# EAGLE design MODUL_RAIL_IN_V100 (EAGLE 6.4)

## Sheet 1 of 2
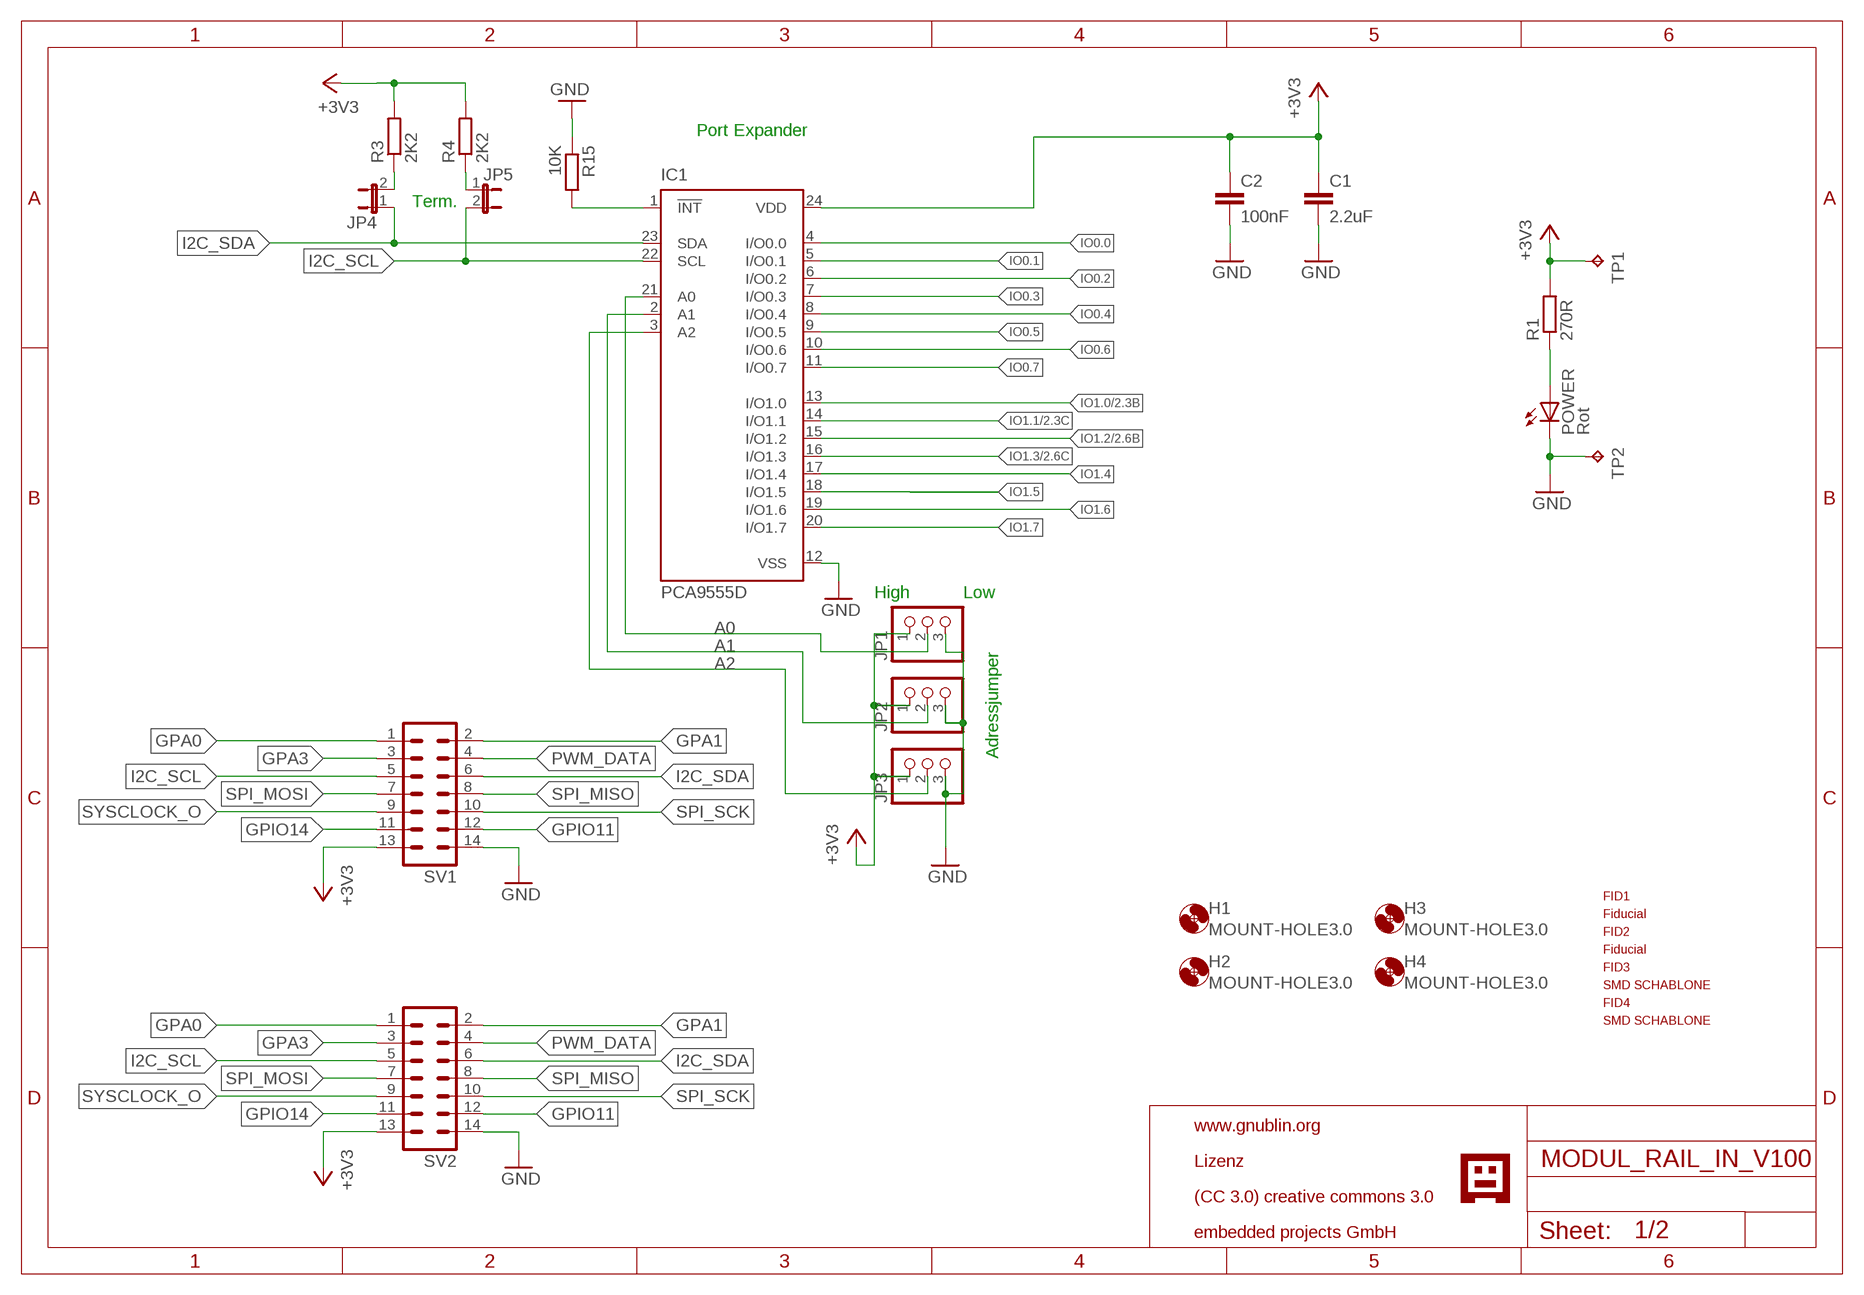
[diagram p0: schematic, sheet 1]

### Parts
C1  2.2uF  C-EUC0805  [C0805]
C2  100nF  C-EUC0805  [C0805]
FID1  PASSERMARKEN_FIDUCIAL  [PASSERMARKEN_FIDUCIAL]
FID2  PASSERMARKEN_FIDUCIAL  [PASSERMARKEN_FIDUCIAL]
FID3  PASSERMARKEN_FIDUCIAL  [PASSERMARKEN_FIDUCIAL]
FID4  PASSERMARKEN_FIDUCIAL  [PASSERMARKEN_FIDUCIAL]
H1  MOUNT-HOLE3.0  [3,0]
H2  MOUNT-HOLE3.0  [3,0]
H3  MOUNT-HOLE3.0  [3,0]
H4  MOUNT-HOLE3.0  [3,0]
IC1  PCA9555D  [SO24]
JP1  PINHD-1X3  [1X03]
JP2  PINHD-1X3  [1X03]
JP3  PINHD-1X3  [1X03]
JP4  JP1E  [JP1]
JP5  JP1E  [JP1]
POWER  Rot  LEDCHIP-LED0805  [CHIP-LED0805]
R1  270R  R-EU_R0805  [R0805]
R3  2K2  R-EU_R0805  [R0805]
R4  2K2  R-EU_R0805  [R0805]
R15  10K  R-EU_R0805  [R0805]
SV1  ML14  [ML14]
SV2  ML14  [ML14]
TP1  TPB1,27  [B1,27]
TP2  TPB1,27  [B1,27]
U$2  GNUBLINLOGOSIEB  [GNUSIEBDRUCK]

### Nets
!INT: IC1.1(!INT) R15.2
+3V3: C1.1 C2.1 IC1.24(VDD) JP1.1 JP2.1 JP3.1 R1.2 R3.2 R4.2 SV1.13 SV2.13 TP1.TP ; also sheet 2
A0: IC1.21(A0) JP1.2
A1: IC1.2(A1) JP2.2
A2: IC1.3(A2) JP3.2
GND: C1.2 C2.2 IC1.12(VSS) JP1.3 JP2.3 JP3.3 POWER.C R15.1 SV1.14 SV2.14 TP2.TP ; also sheet 2
GPA0: SV1.1 SV2.1
GPA1: SV1.2 SV2.2
GPA3: SV1.3 SV2.3
GPIO11: SV1.12 SV2.12
GPIO14: SV1.11 SV2.11
I2C_SCL: IC1.22(SCL) JP5.2 SV1.5 SV2.5
I2C_SDA: IC1.23(SDA) JP4.1 SV1.6 SV2.6
IO0.0: IC1.4(I/O0.0)
IO0.1: IC1.5(I/O0.1)
IO0.2: IC1.6(I/O0.2)
IO0.3: IC1.7(I/O0.3)
IO0.4: IC1.8(I/O0.4)
IO0.5: IC1.9(I/O0.5)
IO0.6: IC1.10(I/O0.6)
IO0.7: IC1.11(I/O0.7)
IO1.0: IC1.13(I/O1.0) ; also sheet 2
IO1.1: IC1.14(I/O1.1) ; also sheet 2
IO1.2: IC1.15(I/O1.2) ; also sheet 2
IO1.3: IC1.16(I/O1.3) ; also sheet 2
IO1.4: IC1.17(I/O1.4)
IO1.5: IC1.18(I/O1.5)
IO1.6: IC1.19(I/O1.6)
IO1.7: IC1.20(I/O1.7)
N$1: JP4.2 R3.1
N$2: POWER.A R1.1
N$5: JP5.1 R4.1
PWM_DATA: SV1.4 SV2.4
SPI_MISO: SV1.8 SV2.8
SPI_MOSI: SV1.7 SV2.7
SPI_SCK: SV1.10 SV2.10
SYSCLOCK_O: SV1.9 SV2.9

### Notes on the sheet
- Port Expander
- Term.
- High | Low
- Adressjumper
- www.gnublin.org
- Lizenz
- (CC 3.0) creative commons 3.0
- embedded projects GmbH

## Sheet 2 of 2
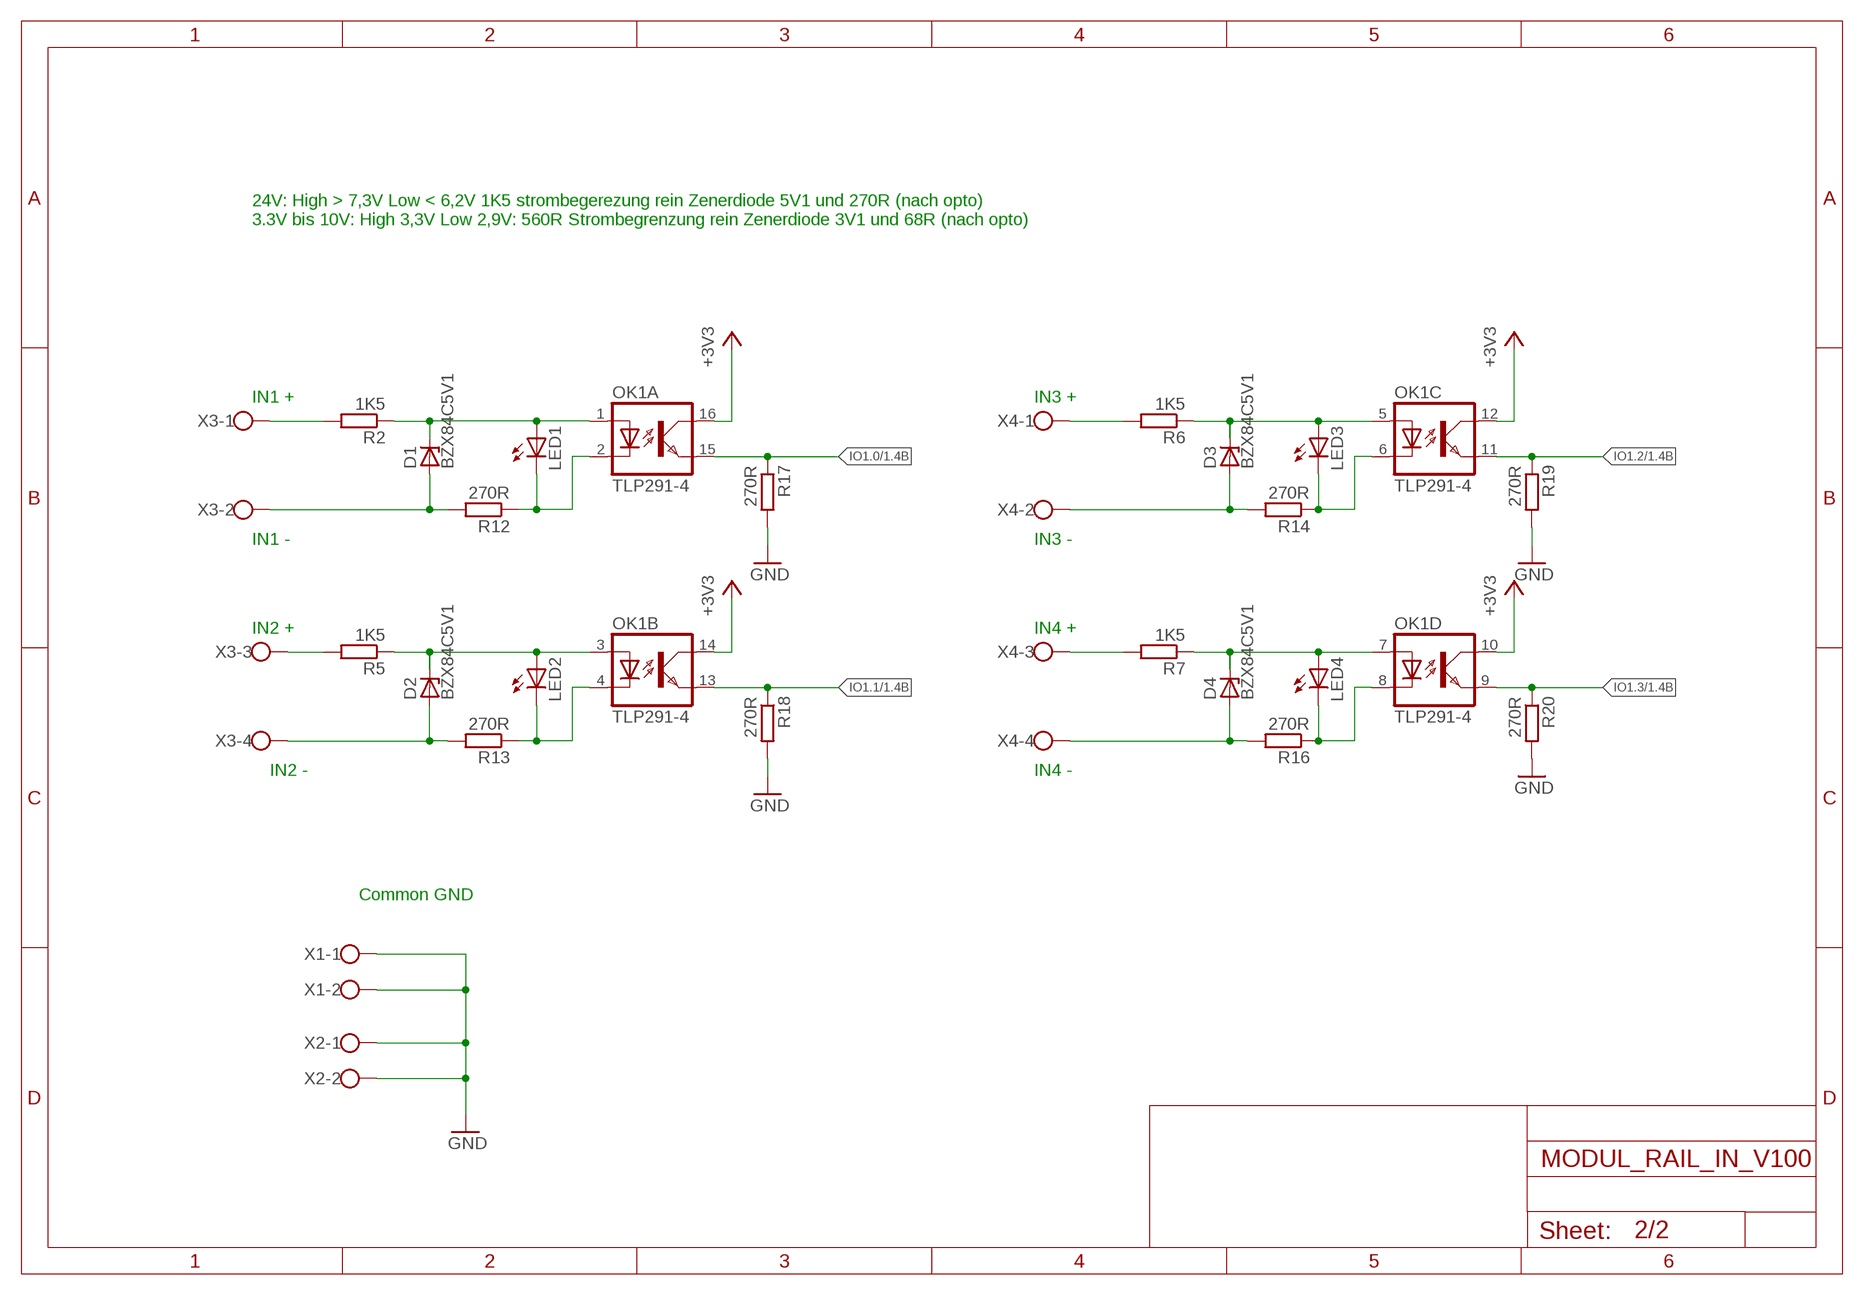
[diagram p1: schematic, sheet 2]

### Parts
D1  BZX84C5V1  BZX84CSMD  [TO236]
D2  BZX84C5V1  BZX84CSMD  [TO236]
D3  BZX84C5V1  BZX84CSMD  [TO236]
D4  BZX84C5V1  BZX84CSMD  [TO236]
LED1  LEDCHIPLED_0805  [CHIPLED_0805]
LED2  LEDCHIPLED_0805  [CHIPLED_0805]
LED3  LEDCHIPLED_0805  [CHIPLED_0805]
LED4  LEDCHIPLED_0805  [CHIPLED_0805]
OK1  TLP291-4  TLP283-4  [MINI-FLAT-16]
R2  1K5  R-EU_R0805  [R0805]
R5  1K5  R-EU_R0805  [R0805]
R6  1K5  R-EU_R0805  [R0805]
R7  1K5  R-EU_R0805  [R0805]
R12  270R  R-EU_R0805  [R0805]
R13  270R  R-EU_R0805  [R0805]
R14  270R  R-EU_R0805  [R0805]
R16  270R  R-EU_R0805  [R0805]
R17  270R  R-EU_R0805  [R0805]
R18  270R  R-EU_R0805  [R0805]
R19  270R  R-EU_R0805  [R0805]
R20  270R  R-EU_R0805  [R0805]
X1  W237-02P  [W237-132]
X2  W237-02P  [W237-132]
X3  W237-04P  [W237-4P]
X4  W237-04P  [W237-4P]

### Nets
+3V3: OK1.10(D:COL) OK1.12(C:COL) OK1.14(B:COL) OK1.16(A:COL) ; also sheet 1
GND: R17.2 R18.2 R19.2 R20.2 X1.1 X1.2 X2.1 X2.2 ; also sheet 1
IO1.0: OK1.15(A:EMIT) R17.1 ; also sheet 1
IO1.1: OK1.13(B:EMIT) R18.1 ; also sheet 1
IO1.2: OK1.11(C:EMIT) R19.1 ; also sheet 1
IO1.3: OK1.9(D:EMIT) R20.1 ; also sheet 1
N$3: R2.2 X3.1
N$4: D1.C LED1.A OK1.1(A:A) R2.1
N$6: LED1.C OK1.2(A:C) R12.1
N$7: R5.2 X3.3
N$8: D2.C LED2.A OK1.3(B:A) R5.1
N$9: LED2.C OK1.4(B:C) R13.1
N$10: D1.A R12.2 X3.2
N$11: R6.2 X4.1
N$12: D3.C LED3.A OK1.5(C:A) R6.1
N$13: R7.2 X4.3
N$14: D4.C LED4.A OK1.7(D:A) R7.1
N$15: LED3.C OK1.6(C:C) R14.1
N$16: D2.A R13.2 X3.4
N$17: LED4.C OK1.8(D:C) R16.1
N$18: D3.A R14.2 X4.2
N$19: D4.A R16.2 X4.4

### Notes on the sheet
- 24V: High > 7,3V Low < 6,2V 1K5 strombegerezung rein Zenerdiode 5V1 und 270R (nach opto)
  3.3V bis 10V: High 3,3V Low 2,9V: 560R Strombegrenzung rein Zenerdiode 3V1 und 68R (nach opto)
- IN1 + | IN3 +
- IN1 - | IN3 -
- IN2 + | IN4 +
- IN2 - | IN4 -
- Common GND

## Library data of the parts
C1 C2 = rcl:C-EU: CAPACITOR, European symbol
D1 = diode:BZX84CSMD: Z DIODE; FARNELL: 1081430
D2-D4 = diode:BZX84CSMD: Z DIODE
FID1 FID2 = KUBUS3:PASSERMARKEN_FIDUCIAL: SMD Passermarke
FID3 FID4 = SMDSCHABLONE:PASSERMARKEN_FIDUCIAL: SMD Passermarke
H1-H4 = holes:MOUNT-HOLE: MOUNTING HOLE with drill center marker
IC1 = micro-philips:PCA9555: 16-bit I2C and SMBus I/O port with interrupt Source: PCA9555_5.pdf; MPN: PCA9555DW; OC_FARNELL: 8906076; OC_NEWARK: 63K6067
JP1-JP3 = pinhead:PINHD-1X3: PIN HEADER
JP4 JP5 = jumper:JP1E: JUMPER
LED1-LED4 POWER = led:LED: LED OSRAM: - CHIPLED LG R971, LG N971, LY N971, LG Q971, LY Q971, LO R971, LY R971 LH N974, LH R974 LS Q976, LO Q976, LY Q976 LO Q996 - Hyper CHIPLED LW Q18S LB Q993, LB Q99A, LB R99A - SideLED LS A670, LO A670, LY A670, LG A670, LP A670 LB A673, LV A673, LT A673, LW A673 LH A674 LY A675 LS A676, LA A676, LO A676, LY A676, LW A676 LS A679, LY A679, LG A679 - Hyper Micro SIDELED® LS Y876, LA Y876, LO Y876, LY Y876 LT Y87S - SmartLED LW L88C, LW L88S LB L89C, LB L89S, LG L890 LS L89K, LO L89K, LY L89K LS L896, LA L896, LO L896, LY L896 - TOPLED LS T670, LO T670, LY T670, LG T670, LP T670 LSG T670, LSP T670, LSY T670, LOP T670, LYG T670 LG T671, LOG T671, LSG T671 LB T673, LV T673, LT T673, LW T673 LH T674 LS T676, LA T676, LO T676, LY T676, LB T676, LH T676, LSB T676, LW T676 LB T67C, LV T67C, LT T67C, LS T67K, LO T67K, LY T67K, LW E67C LS E67B, LA E67B, LO E67B, LY E67B, LB E67C, LV E67C, LT E67C LW T67C LS T679, LY T679, LG T679 LS T770, LO T770, LY T770, LG T770, LP T770 LB T773, LV T773, LT T773, LW T773 LH T774 LS E675, LA E675, LY E675, LS T675 LS T776, LA T776, LO T776, LY T776, LB T776 LHGB T686 LT T68C, LB T68C - Hyper Mini TOPLED® LB M676 - Mini TOPLED Santana® LG M470 LS M47K, LO M47K, LY M47K Source: http://www.osram.convergy.de LUXEON: - LUMILED® LXK2-PW12-R00, LXK2-PW12-S00, LXK2-PW14-U00, LXK2-PW14-V00 LXK2-PM12-R00, LXK2-PM12-S00, LXK2-PM14-U00 LXK2-PE12-Q00, LXK2-PE12-R00, LXK2-PE12-S00, LXK2-PE14-T00, LXK2-PE14-U00 LXK2-PB12-K00, LXK2-PB12-L00, LXK2-PB12-M00, LXK2-PB14-N00, LXK2-PB14-P00, LXK2-PB14-Q00 LXK2-PR12-L00, LXK2-PR12-M00, LXK2-PR14-Q00, LXK2-PR14-R00 LXK2-PD12-Q00, LXK2-PD12-R00, LXK2-PD12-S00 LXK2-PH12-R00, LXK2-PH12-S00 LXK2-PL12-P00, LXK2-PL12-Q00, LXK2-PL12-R00 Source: www.luxeon.com KINGBRIGHT: KA-3528ASYC Source: www.kingbright.com
OK1 = optocoupler:TLP283-4: TOSHIBA PHOTOCOUPLER GaAs IRED & PHOTO-TRANSISTOR Source: http://www.semicon.toshiba.co.jp/td/en/Opto/Photocoupler/en_20050928_TLP283_datasheet.pdf
R1-R7 R12-R20 = rcl:R-EU_: RESISTOR, European symbol
SV1 SV2 = con-ml:ML14: HARTING; OC_FARNELL: unknown; OC_NEWARK: unknown
TP1 TP2 = testpad:TP: Test pad
U$2 = EmbeddedProjectsLogos2:GNUBLINLOGO
X1 X2 = con-wago-508:W237-02P: WAGO SREW CLAMP
X3 X4 = con-wago-508:W237-04P: WAGO SREW CLAMP

## Board
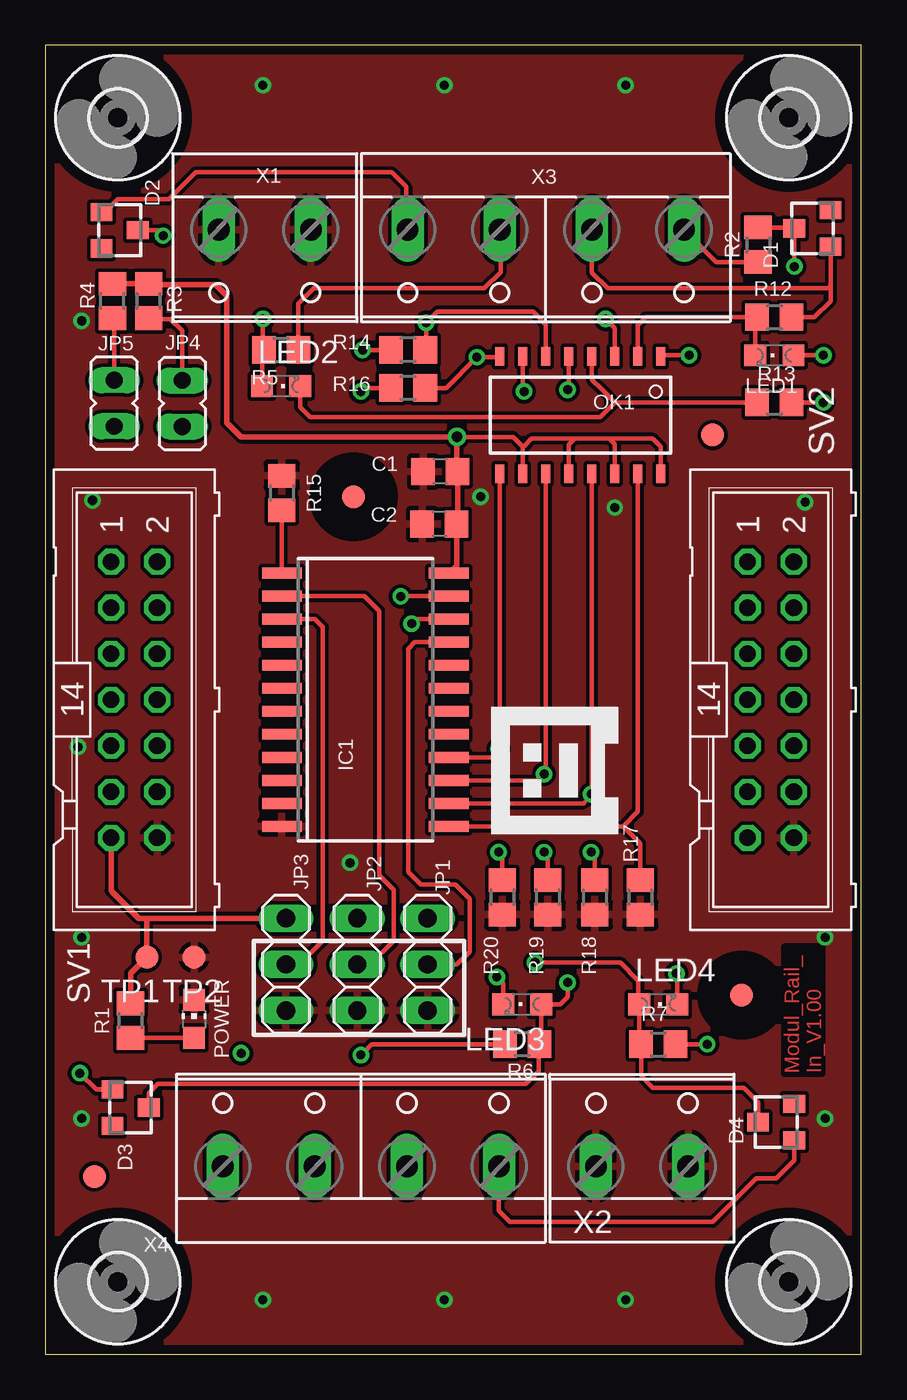
[diagram p2: board, top side]
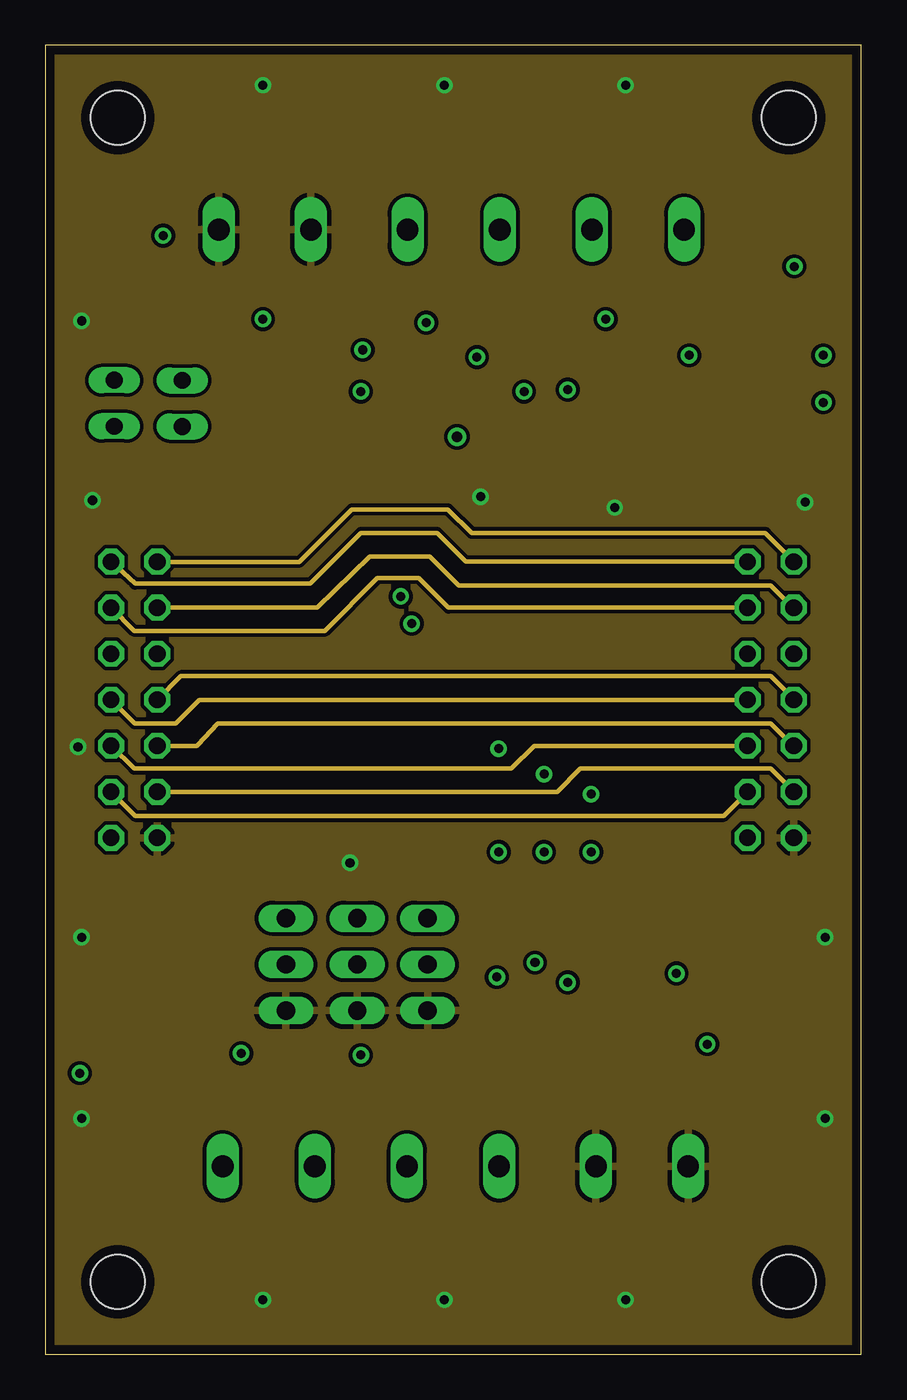
[diagram p3: board, inner layer Route2]
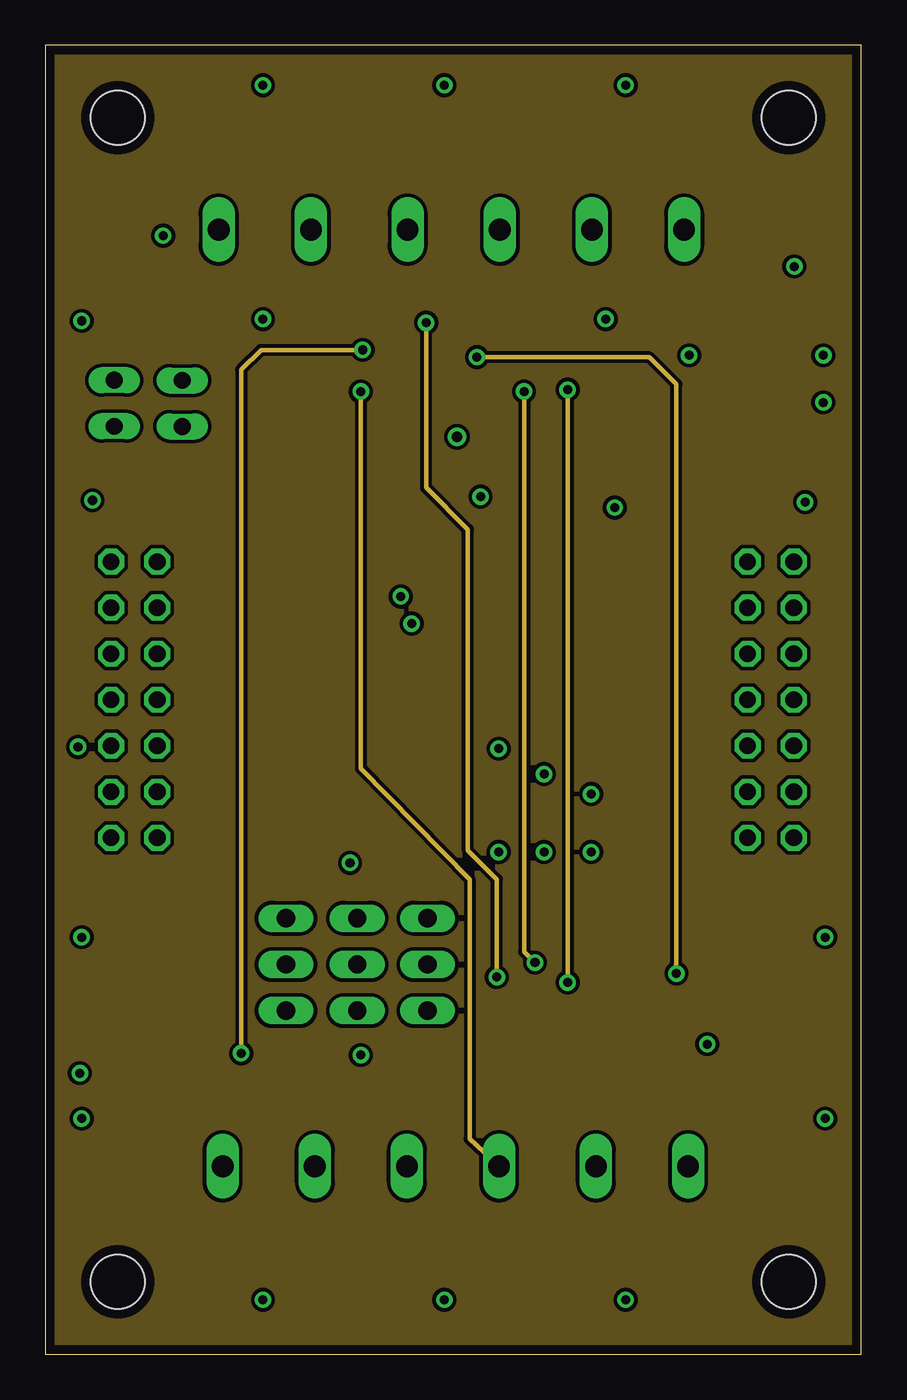
[diagram p4: board, inner layer Route15]
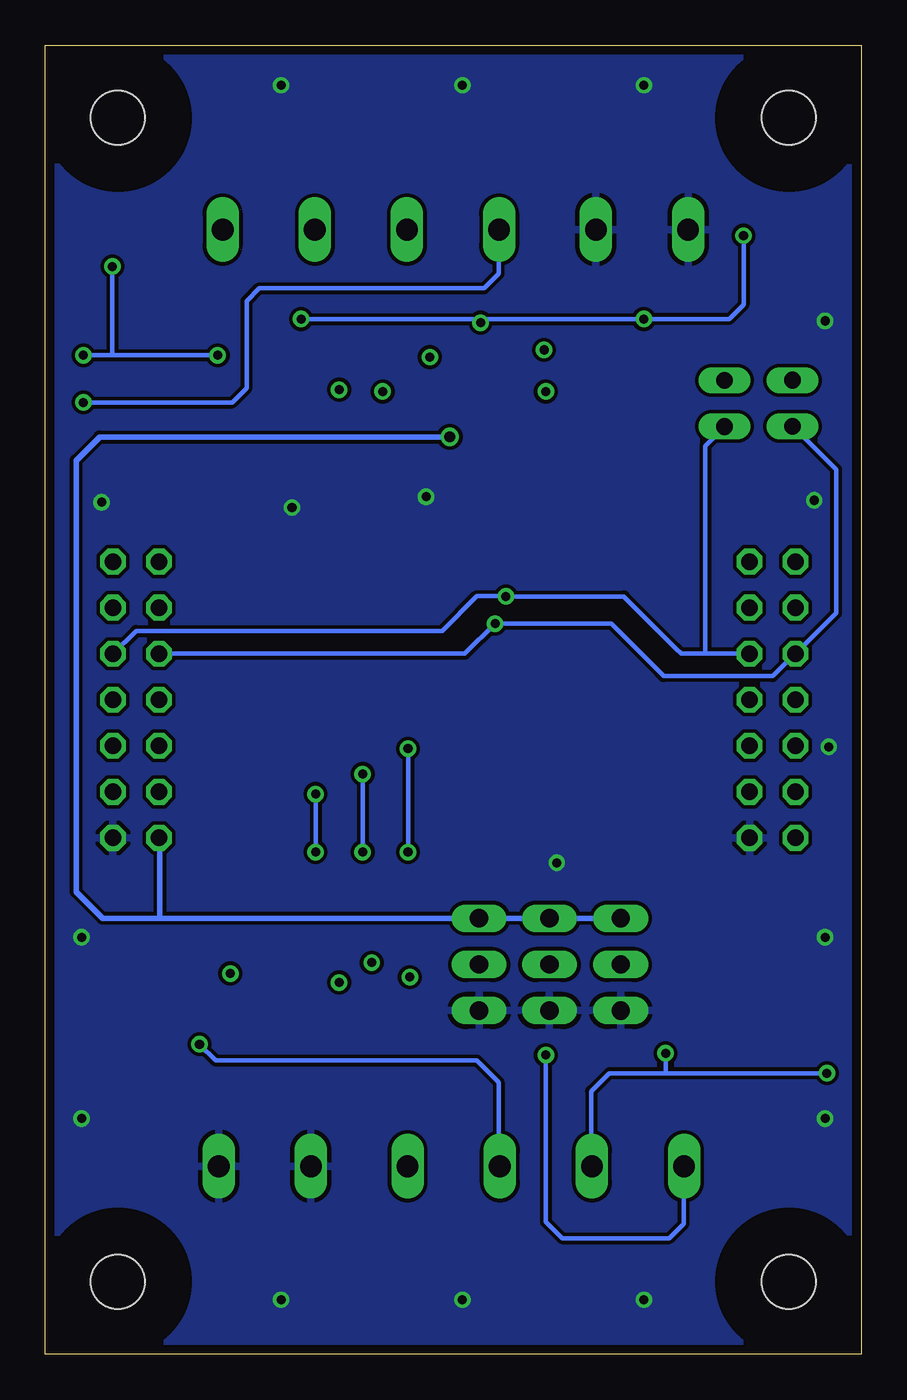
[diagram p5: board, bottom side, seen from below]

Size 45 x 72.2 mm. Coordinates in mm from the lower left corner, seen from the top.
Outline: 0,0 45,0 45,72.2 0,72.2 0,0
Copper layers (1*2+15*16): Top 0.035mm / dielectric 1.5mm / Route2 0.035mm / dielectric 0.15mm / Route15 0.035mm / dielectric 0.2mm / Bottom 0.035mm
Design rules "default *": minimum track width 10mil, minimum drill 24mil, track to track 8mil, track to pad 8mil, pad to pad 8mil, via to via 8mil, smd to smd 8mil, copper to edge 20mil, drill to drill 8mil, minimum pad ring 10mil, minimum via ring 8mil, stop-mask expansion 4mil, vias tented up to drill 40mil, thermal gap 10mil

### Footprints (pad centres in the part's own frame; a part is rotated, then mirrored left to right if it is on the bottom)
C0805 = smd 1.3 x 1.5: 1 -0.95,0; 2 0.95,0
TO236 = smd 1 x 1.2: A -1,-1; C 0,1; NC 1,-1
PASSERMARKEN_FIDUCIAL = smd 1.27 x 1.27: 1 0,0
3,0 = hole 3: 0,0
SO24 = smd 0.6 x 2.2: 1 -6.985,-4.6; 2 -5.715,-4.6; 3 -4.445,-4.6; 4 -3.175,-4.6; 5 -1.905,-4.6; 6 -0.635,-4.6; 7 0.635,-4.6; 8 1.905,-4.6; 9 3.175,-4.6; 10 4.445,-4.6; 11 5.715,-4.6; 12 6.985,-4.6; 13 6.985,4.6; 14 5.715,4.6; 15 4.445,4.6; 16 3.175,4.6; 17 1.905,4.6; 18 0.635,4.6; 19 -0.635,4.6; 20 -1.905,4.6; 21 -3.175,4.6; 22 -4.445,4.6; 23 -5.715,4.6; 24 -6.985,4.6
1X03 = drill 1.016 long: 1 -2.54,0; 2 0,0; 3 2.54,0
JP1 = drill 0.914 long: 1 0,-1.27; 2 0,1.27
CHIPLED_0805 = smd 1.2 x 1.2: A 0,-1.05; C 0,1.05
MINI-FLAT-16 = smd 1 x 0.5: 1 -3.24,4.445; 2 -3.24,3.175; 3 -3.24,1.905; 4 -3.24,0.635; 5 -3.24,-0.635; 6 -3.24,-1.905; 7 -3.24,-3.175; 8 -3.24,-4.445; 9 3.24,-4.445; 10 3.24,-3.175; 11 3.24,-1.905; 12 3.24,-0.635; 13 3.24,0.635; 14 3.24,1.905; 15 3.24,3.175; 16 3.24,4.445
CHIP-LED0805 = smd 1.2 x 1.2: A 0,-1.05; C 0,1.05
R0805 = smd 1.3 x 1.5: 1 -0.95,0; 2 0.95,0
ML14 = drill 0.914 octagon: 1 -7.62,-1.27; 2 -7.62,1.27; 3 -5.08,-1.27; 4 -5.08,1.27; 5 -2.54,-1.27; 6 -2.54,1.27; 7 0,-1.27; 8 0,1.27; 9 2.54,-1.27; 10 2.54,1.27; 11 5.08,-1.27; 12 5.08,1.27; 13 7.62,-1.27; 14 7.62,1.27
B1,27 = smd 1.27 x 1.27: TP 0,0
W237-132 = drill 1.194 long: 1 -2.54,-0.635; 2 2.54,-0.635
W237-4P = drill 1.194 long: 1 -7.62,-0.635; 2 -2.54,-0.635; 3 2.54,-0.635; 4 7.62,-0.635

### Placement (x,y rotation side)
C1  21.78,48.69 180 top
C2  21.73,45.79 180 top
D1  42.3,62.1 90 top
D2  4.1,62 270 top
D3  4.7,13.6 270 top
D4  40.3,12.8 90 top
FID1  17,47.3 0 top
FID2  38.4,19.8 0 top
FID3  36.8,50.7 0 top
FID4  2.7,9.8 0 top
H1  4,4 0 top
H2  41,4 0 top
H3  41,68.2 0 top
H4  4,68.2 0 top
IC1  17.65,36.1 270 top
JP1  21.08,21.5 270 top
JP2  17.2,21.5 270 top
JP3  13.27,21.5 270 top
JP4  7.55,52.44 0 top
JP5  3.8,52.46 180 top
LED1  40.2,55.1 90 top
LED2  13,53.4 270 top
LED3  26.3,19.3 90 top
LED4  33.8,19.3 270 top
OK1  29.5,51.8 270 top
POWER  8.2,18.5 0 top
R1  4.7,18.4 90 top
R2  39.3,61.2 270 top
R3  5.7,58.1 90 top
R4  3.7,58.1 90 top
R5  13,55.4 0 top
R6  26.3,17.1 180 top
R7  33.8,17.1 0 top
R12  40.2,57.2 0 top
R13  40.2,52.5 0 top
R14  20,55.4 180 top
R15  13.04,47.51 270 top
R16  20,53.3 180 top
R17  32.8,25.2 270 top
R18  30.3,25.2 270 top
R19  27.7,25.2 270 top
R20  25.2,25.2 270 top
SV1  4.9,36.1 270 top
SV2  40,36.1 270 top
TP1  5.6,21.9 0 top
TP2  8.2,21.9 0 top
U$2  31.6,28.7 90 top
X1  12.1,61.4 180 top
X2  32.9,11 0 top
X3  27.6,61.4 180 top
X4  17.4,11 0 top

### Tracks (layer width: path | path; a pad name or v marks a point on that pad's centre or on a via)
!INT
  Top 0.254: IC1.1 R15.2
+3V3  (via drill 0.6)
  Top 0.254: 31.1,50.5 33.5,50.5 33.95,50.05 OK1.16 | 31.1,50.5 29.2,50.5 | 29.2,50.5 26.8,50.5 26.4,50.1 26.32,50.02 | OK1.10 26.32,50.02 | 29.2,50.5 28.86,50.16 OK1.12 | 31.1,50.5 31.41,50.2 OK1.14 | 26.32,50.02 26.32,50.08 25.8,50.6 v22.7,50.6
  Top 0.305: IC1.24 22.68,43.52 C2.1 22.73,46.44 C1.1 22.7,48.72 v22.7,50.6 22.2,50.6 10.8,50.6 10,51.4 10,58.3 10,58.4 9.4,59 5.75,59 R3.2 R4.2 | JP3.1 5.5,24.04 | 5.5,24.04 5.16,24.04 3.7,25.5 3.63,25.57 SV1.13 | R1.2 4.7,21 TP1.TP 5.6,23.94 5.5,24.04
  Bottom 0.305: SV2.13 38.7,28.45 38.7,24.04 | v22.7,50.6 22.8,50.6 42,50.6 43.3,49.3 43.3,27.1 43.3,25.5 41.84,24.04 38.7,24.04 | JP3.1 JP2.1 JP1.1 37.27,24.04 38.7,24.04
A0
  Top 0.254: IC1.21 20.38,39.27 20,38.9 20,26.6 20.7,25.9 22.6,25.9 23.4,25.1 23.4,22.2 22.7,21.5 JP1.2
A1
  Top 0.254: IC1.2 17.59,41.81 18.4,41 18.4,26.4 19.2,25.6 19.2,22.8 17.9,21.5 JP2.2
A2
  Top 0.254: JP3.2 14,21.5 15.3,22.8 15.3,40.1 15.1,40.3 14.86,40.55 IC1.3
GND  (via drill 0.5)
  other vias: 2,23 1.8,33.5 2,57 2.6,47.1 2,13 12,3 22,3 32,3 43,13 43,23 41.9,47 12,70 22,70 32,70 16.8,27.1 31.4,46.7 24,47.3
  pour Bottom: -2.7,-3.6 50.2,-3.3 49.2,75.6 -3.7,75.3
  pour Top: -2.7,-3.3 49.6,-3.1 49,74.9 -3.3,74.7
  pour Route2: -0.6,72.7 45.3,72.6 45.5,-1.6 -0.4,-1.5
GNDA
  pour Route15: 0.2,72.5 45.2,72.4 45,-0.2 0,-0.1
GPA0
  Route2 0.254: SV2.1 23.18,43.72 21.6,45.3 17.4,45.3 14.6,42.5 4.95,42.5 SV1.1
GPA1
  Route2 0.254: SV2.2 39.7,45.3 23.5,45.3 22.2,46.6 16.9,46.6 14,43.7 6.19,43.7 SV1.2
GPA3
  Route2 0.254: SV2.3 22.22,41.18 20.6,42.8 18.3,42.8 15.4,39.9 4.91,39.9 SV1.3
GPIO11
  Route2 0.254: SV2.12 40,32.3 29.5,32.3 28.22,31.02 SV1.12
GPIO14
  Route2 0.254: SV1.11 4.95,29.7 37.41,29.7 SV2.11
I2C_SCL  (via drill 0.5)
  Top 0.254: IC1.22 20.45,40.55 v20.2,40.3
  Bottom 0.254: JP5.2 1.4,48.8 1.4,40.87 SV1.5 3.66,38.64 4.9,37.4 10.9,37.4 11.1,37.6 13.8,40.3 v20.2,40.3 21.86,38.64 SV2.5
I2C_SDA  (via drill 0.5)
  Top 0.254: IC1.23 19.61,41.81 v19.6,41.8
  Bottom 0.254: SV1.6 7.6,38.64 8.6,38.64 | 8.6,38.64 9.94,38.64 10.2,38.9 13.1,41.8 v19.6,41.8 19.61,41.81 21.2,41.81 23.11,39.9 40,39.9 SV2.6 | JP4.1 7.55,51.15 8.6,50.1 8.6,38.64
IO1.0
  Top 0.254: OK1.15 32.67,29.93 31.86,29.11 | IC1.13 31.82,29.11 31.86,29.11 | R17.1 32.8,28.18 31.86,29.11
IO1.1  (via drill 0.5)
  Top 0.254: IC1.14 29.68,30.39 v30.1,30.9 30.14,30.96 OK1.13 | v30.1,27.7 30.3,27.5 R18.1
  Bottom 0.254: v30.1,30.9 v30.1,27.7
IO1.2  (via drill 0.5)
  Top 0.254: IC1.15 27.16,31.66 v27.5,32 27.59,32.1 OK1.11 | v27.5,27.7 27.7,27.5 R19.1
  Bottom 0.254: v27.5,32 v27.5,27.7
IO1.3  (via drill 0.5)
  Top 0.254: IC1.16 24.62,32.92 v25,33.4 25.05,33.45 OK1.9 | v25,27.7 25.2,27.5 R20.1
  Bottom 0.254: v25,33.4 v25,27.7
N$1
  Top 0.254: JP4.2 7.55,56.45 6.9,57.1 5.75,57.1 R3.1
N$2
  Top 0.254: R1.1 POWER.A
N$3
  Top 0.254: R2.2 37.01,60.25 X3.1
N$4  (via drill 0.5)
  Top 0.254: R2.1 41.3,62.15 D1.C v41.3,60 | v35.5,55.1 34.01,55.1 OK1.1 | LED1.A v42.9,55.1
  Bottom 0.254: v42.9,55.1 LED1.A | LED1.A v35.5,55.1 | v41.3,60 41.3,55.15 LED1.A
N$5
  Top 0.254: JP5.1 3.8,56.92 R4.1
N$6
  Top 0.254: OK1.2 32.67,56.77 33.1,57.2 R12.1 39.15,57.1 LED1.C
N$7
  Top 0.254: R5.2 13.95,57.95 14.8,58.8 24.2,58.8 25.1,59.7 25.1,61.99 X3.3
N$8  (via drill 0.5)
  Top 0.254: LED2.A 11.95,55.3 R5.1 12,55.45 v12,57.1 | D2.C 6.2,62 v6.5,61.7 | OK1.3 31.41,56.59 v30.9,57.1
  Bottom 0.254: v6.5,61.7 6.5,57.9 7.3,57.1 11.7,57.1 v12,57.1 v30.9,57.1
N$9
  Top 0.254: OK1.4 30.14,53.77 30.7,53.2 31.4,52.5 | R13.1 31.4,52.5 | LED2.C 14.05,52.25 14.6,51.7 30.6,51.7 31.4,52.5
N$10
  Top 0.254: D1.A 43.3,59 | 43.3,59 43.3,58.1 42.4,57.2 R12.2 | X3.2 30.14,59.66 31,58.8 43.2,58.8 43.3,59
N$11  (via drill 0.5)
  Top 0.254: R6.2 18,17.1 v17.4,16.5
  Bottom 0.254: v17.4,16.5 17.4,7.3 16.5,6.4 10.6,6.4 9.8,7.2 9.8,10.35 X4.1
N$12  (via drill 0.5)
  Top 0.254: OK1.5 28.86,53.27 v28.8,53.2 | v28.8,20.5 28.8,19.7 28.4,19.3 LED3.A 27.35,17.2 R6.1 27.2,17.05 27.2,15.6 26.5,14.9 6.2,14.9 5.7,14.4 D3.C
  Route15 0.254: v28.8,53.2 v28.8,20.5
N$13  (via drill 0.5)
  Top 0.254: R7.2 v36.5,17.1
  Bottom 0.254: v36.5,17.1 35.6,16.2 21.2,16.2 20,15 20,10.43 X4.3
N$14  (via drill 0.5)
  Top 0.254: OK1.7 26.32,53.17 v26.4,53.1 | v27,21.6 30,21.6 31.7,21.6 32.7,20.6 32.7,19.35 LED4.A 32.75,17.2 R7.1 32.85,15.35 33.5,14.7 38.5,14.7 39.3,13.9 D4.C
  Route15 0.254: v26.4,53.1 26.4,22.2 v27,21.6
N$15  (via drill 0.5)
  Top 0.254: OK1.6 27.59,56.8 26.9,57.5 21.7,57.5 21.6,57.5 v21,56.9 21,55.45 R14.1 20.9,55.65 | LED3.C 25.25,20.45 v24.9,20.8
  Route15 0.254: v24.9,20.8 24.9,26.2 23.3,27.8 23.3,45.5 21,47.8 v21,56.9
N$16  (via drill 0.5)
  Top 0.254: R13.2 v42.9,52.5 | D2.A 3.3,63 4,63.7 6.8,63.7 8.3,65.2 19.1,65.2 19.9,64.4 19.9,62.12 X3.4
  Bottom 0.254: v42.9,52.5 34.7,52.5 33.9,53.3 33.9,58.1 33.2,58.8 20.8,58.8 20,59.6 20,62.02 X3.4
N$17  (via drill 0.5)
  Top 0.254: LED4.C 34.85,20.95 v34.8,21 | OK1.8 25.02,55 v23.8,55 22.1,53.3 R16.1
  Route15 0.254: v34.8,21 34.8,53.5 33.3,55 v23.8,55
N$18  (via drill 0.5)
  Top 0.254: R14.2 v17.5,55.4 | D3.A 2.8,14.6 v1.9,15.5
  Route15 0.254: v17.5,55.4 11.9,55.4 10.8,54.3 v10.8,16.6
  Bottom 0.254: v1.9,15.5 10.8,15.5 | 10.8,15.5 13.9,15.5 14.9,14.5 14.9,10.4 X4.2 | v10.8,16.6 10.8,15.5
N$19  (via drill 0.5)
  Top 0.254: D4.A 41.3,10.7 40.3,9.7 39.2,9.7 36.8,7.3 25.6,7.3 25,7.9 25,10.35 X4.4 | R16.2 17.6,53.3 v17.4,53.1
  Route15 0.254: v17.4,53.1 17.4,32.3 23.4,26.2 23.4,11.88 X4.4
PWM_DATA
  Route2 0.254: SV2.4 41.22,41.18 40,42.4 22.8,42.4 21.2,44 17.9,44 15,41.2 6.19,41.2 SV1.4
SPI_MISO
  Route2 0.254: SV2.8 41.27,36.13 40,37.4 7.47,37.4 SV1.8
SPI_MOSI
  Route2 0.254: SV2.7 8.5,36.1 7.2,34.8 4.93,34.8 SV1.7
SPI_SCK
  Route2 0.254: SV2.10 41.24,33.56 40,34.8 9.5,34.8 8.4,33.6 8.36,33.56 SV1.10
SYSCLOCK_O
  Route2 0.254: SV1.9 4.89,32.3 25.7,32.3 26.96,33.56 SV2.9

### Text on the board
Top: Modul_Rail_ / In_V1.00
Document: = UMK-BE 45
tDocu: IN2 - | IN2 + | IN1 - | IN1 + | Common GND | I2C-Pullups | SCL | SDA | RAIL / INPUT 4 | www.gnublin.org | High | Low | A2 | A1 | A0 | Common GND | IN3 + | IN3 - | IN4 + | IN4 -